# Altium project ESP32_CUSTOM.PrjPcb (part 1 of 3)
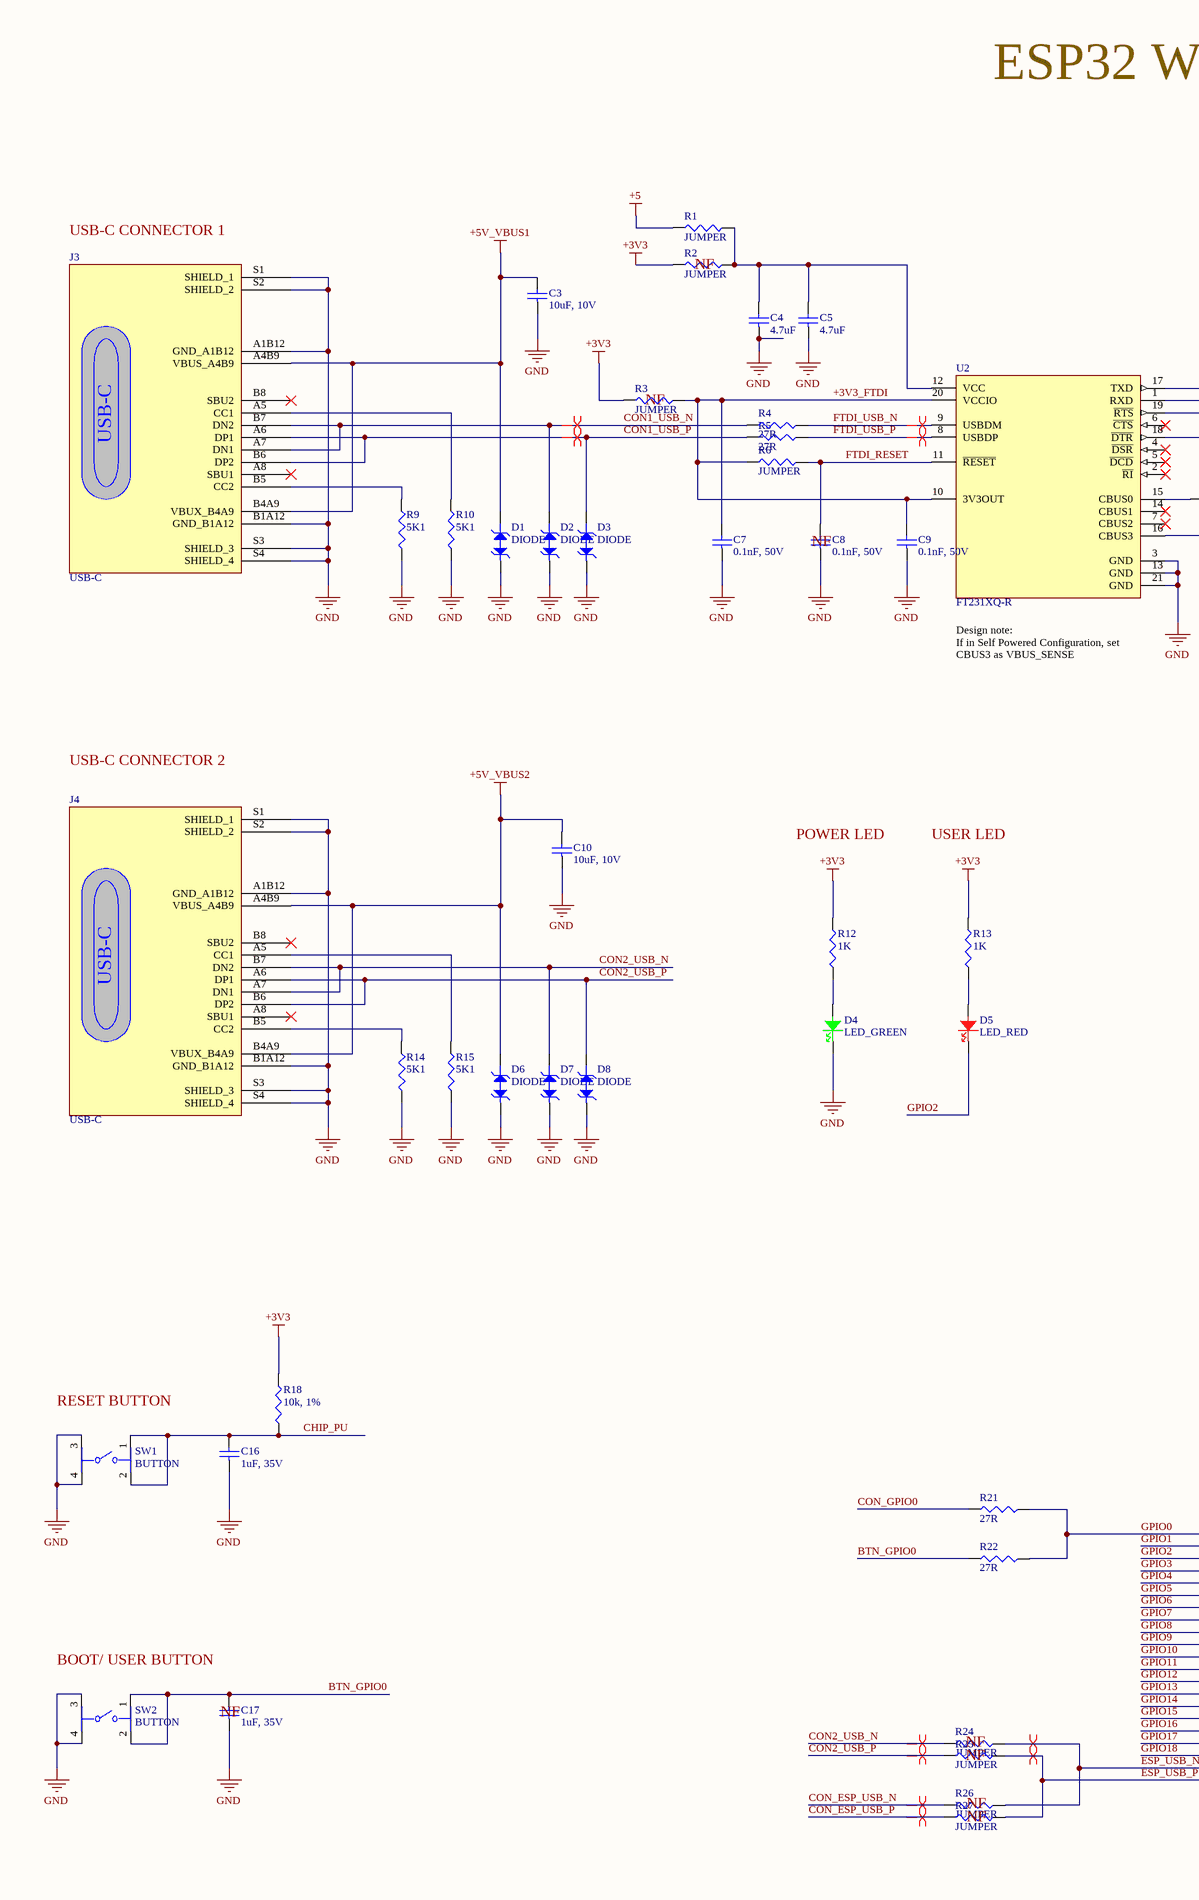
[diagram p0: Sheet1.SchDoc, left]
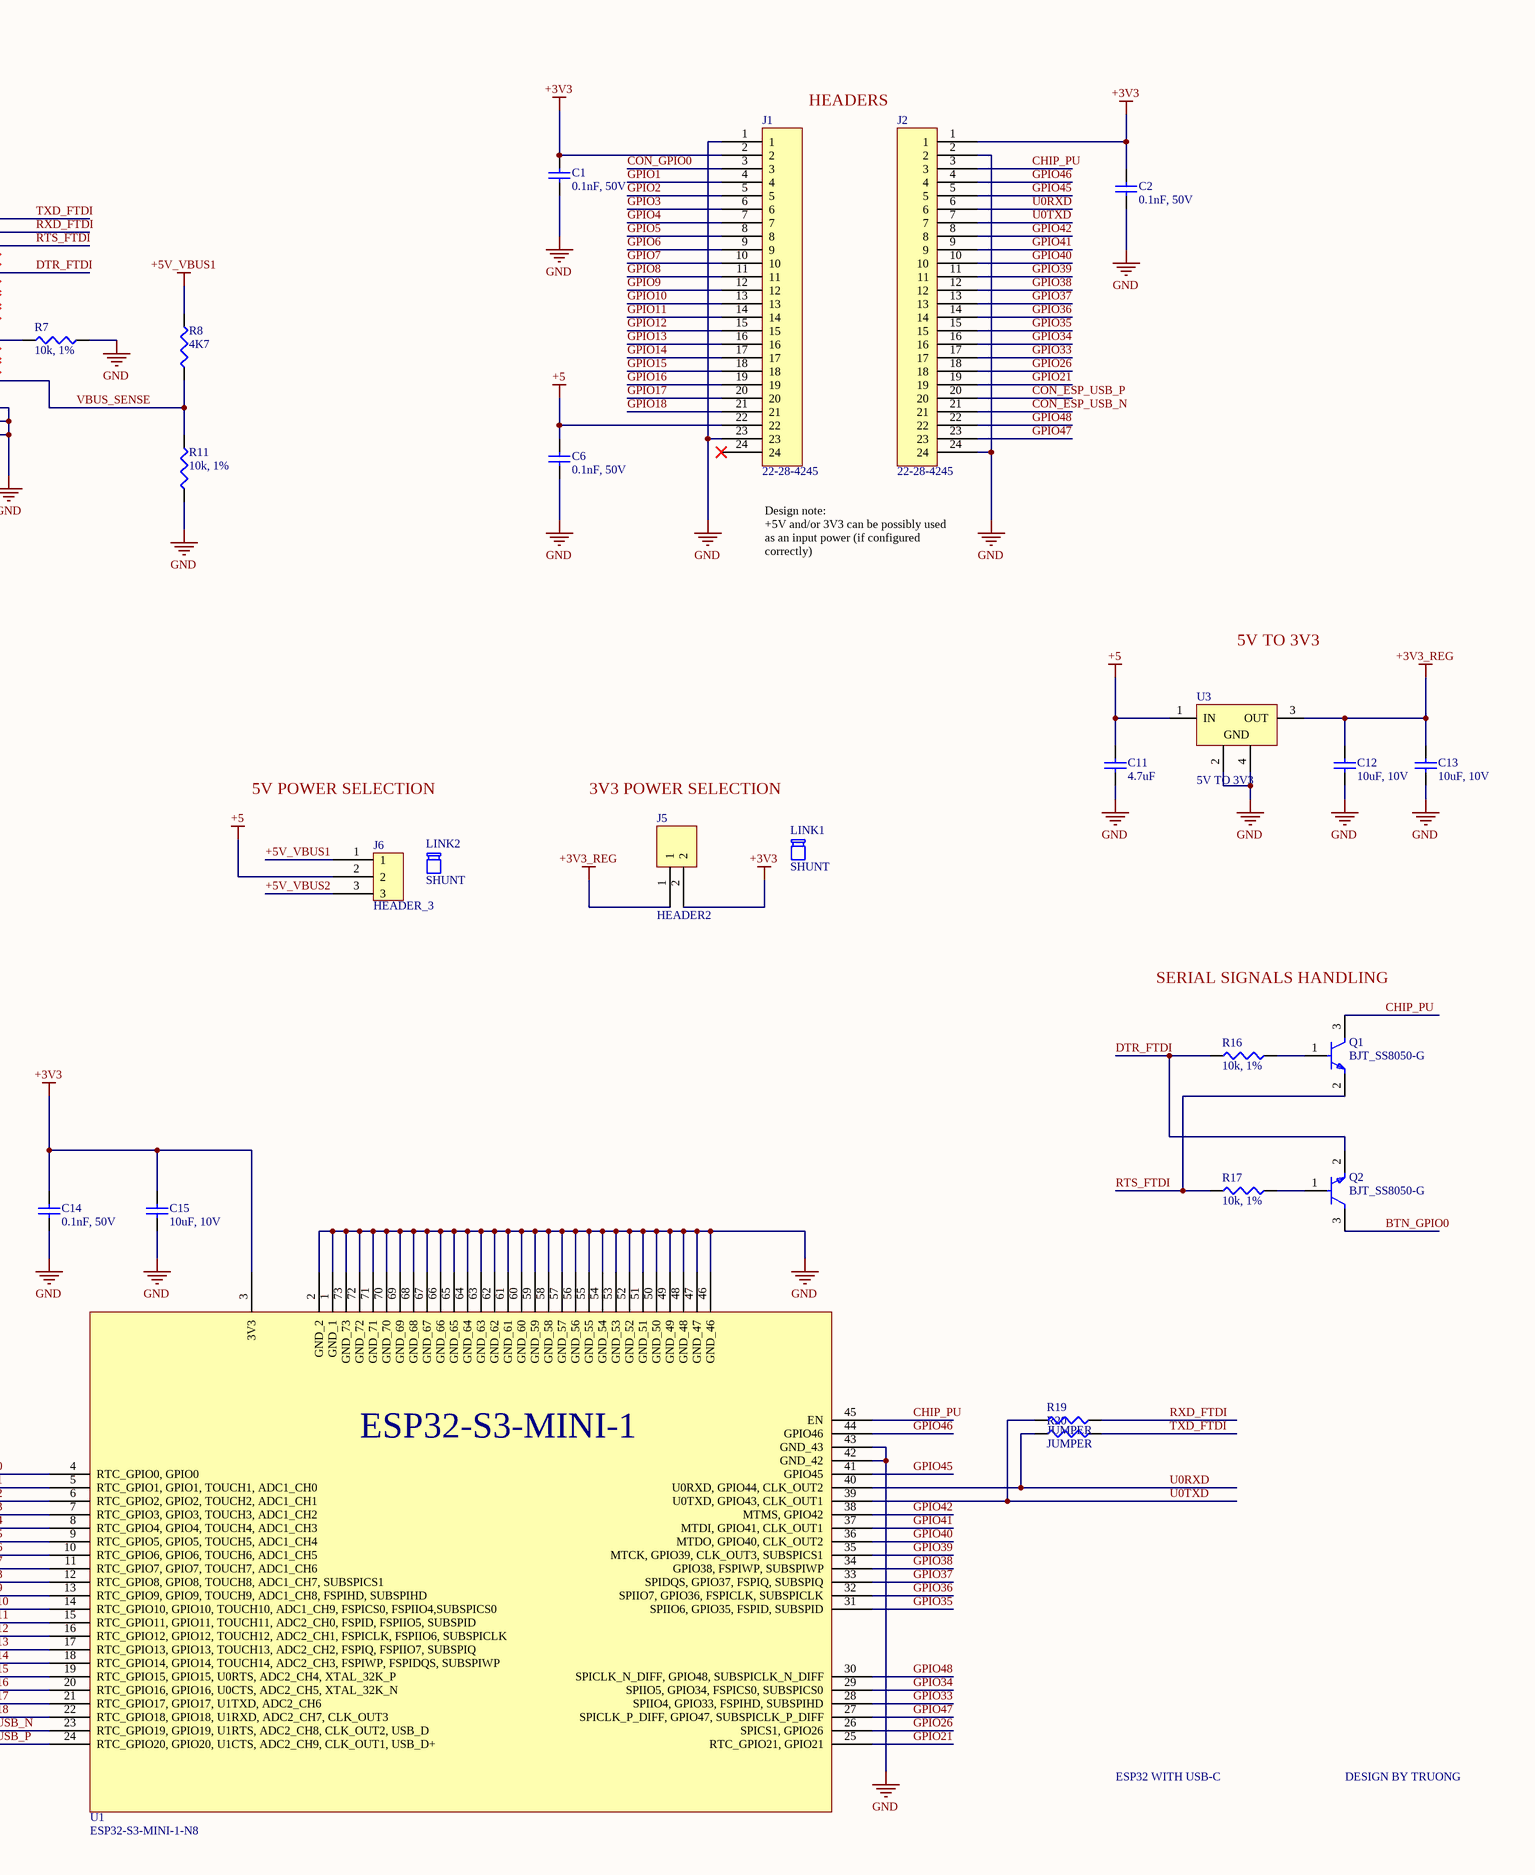
[diagram p1: Sheet1.SchDoc, right]
1 sheet, 66 parts. Net scope: global (net labels, ports and power ports of the same name join across sheets).
Board file: PCB_ESP32.PcbDoc

## Sheet Sheet1.SchDoc
size A2; SheetNumber: 1; SheetTotal: 1

### Parts
C1  0.1nF, 50V  [CAPC1005X70N]
C2  0.1nF, 50V  [CAPC1005X70N]
C3  10uF, 10V  [CAPC1005X70N]
C4  4.7uF  [CAPC1005X70N]
C5  4.7uF  [CAPC1005X70N]
C6  0.1nF, 50V  [CAPC1005X70N]
C7  0.1nF, 50V  [CAPC1005X70N]
C8  0.1nF, 50V  [CAPC1005X70N]
C9  0.1nF, 50V  [CAPC1005X70N]
C10  10uF, 10V  [CAPC1005X70N]
C11  4.7uF  [CAPC1005X70N]
C12  10uF, 10V  [CAPC1005X70N]
C13  10uF, 10V  [CAPC1005X70N]
C14  0.1nF, 50V  [CAPC1005X70N]
C15  10uF, 10V  [CAPC1005X70N]
C16  1uF, 35V  [CAPC1005X70N]
C17  1uF, 35V  [CAPC1005X70N]
D1  DIODE  [SOD882]
D2  DIODE  [SOD882]
D3  DIODE  [SOD882]
D4  LED_GREEN  [LED0402_GREEN]
D5  LED_RED  [LED0402_RED]
D6  DIODE  [SOD882]
D7  DIODE  [SOD882]
D8  DIODE  [SOD882]
J1  22-28-4245  [HDR_1X24_2.55MM]
J2  22-28-4245  [HDR_1X24_2.55MM]
J3  USB-C  [FP-2171790001-MFG]
J4  USB-C  [FP-2171790001-MFG]
J5  HEADER2  [HDR_1X2_1.27MM]
J6  HEADER_3  [HDR_1X3_1.27MM]
LINK1  SHUNT  (mechanical)
LINK2  SHUNT  (mechanical)
Q1  BJT_SS8050-G  [FP-SS8050-G-IPC_B]
Q2  BJT_SS8050-G  [FP-SS8050-G-IPC_B]
R1  JUMPER  [RESC1005X40N]
R2  JUMPER  [RESC1005X40N]
R3  JUMPER  [RESC1005X40N]
R4  27R  [RESC1005X40N]
R5  27R  [RESC1005X40N]
R6  JUMPER  [RESC1005X40N]
R7  10k, 1%  [RESC1005X40N]
R8  4K7  [RESC1005X40N]
R9  5K1  [RESC1005X40N]
R10  5K1  [RESC1005X40N]
R11  10k, 1%  [RESC1005X40N]
R12  1K  [RESC1005X40N]
R13  1K  [RESC1005X40N]
R14  5K1  [RESC1005X40N]
R15  5K1  [RESC1005X40N]
R16  10k, 1%  [RESC1005X40N]
R17  10k, 1%  [RESC1005X40N]
R18  10k, 1%  [RESC1005X40N]
R19  JUMPER  [RESC1005X40N]
R20  JUMPER  [RESC1005X40N]
R21  27R  [RESC1005X40N]
R22  27R  [RESC1005X40N]
R24  JUMPER  [RESC1005X40N]
R25  JUMPER  [RESC1005X40N]
R26  JUMPER  [RESC1005X40N]
R27  JUMPER  [RESC1005X40N]
SW1  BUTTON  [FP-PTS645SM43SMTR92LFS-MFG]
SW2  BUTTON  [FP-PTS645SM43SMTR92LFS-MFG]
U1  ESP32-S3-MINI-1-N8  [XCVR_ESP32-S3-MINI-1-N8]
U2  FT231XQ-R  [FP-QFN-20-IPC_B]
U3  5V TO 3V3  [DCY0004A_N]

### Nets
+3V3: C1.2 C2.2 C14.2 C15.2 J1.2 J2.1 J5.2 R2.1 R3.1 R12.2 R13.2 R18.2 U1.3(3V3)
+3V3_REG: C12.2 C13.2 J5.1 U3.3(OUT)
+5: C6.2 C11.2 J1.22 J6.2 R1.1 U3.1(IN)
+5V_VBUS1: C3.2 D1.2 J3.A4B9(VBUS_A4B9) J3.B4A9(VBUX_B4A9) J6.1 R8.2
+5V_VBUS2: C10.2 D6.2 J4.A4B9(VBUS_A4B9) J4.B4A9(VBUX_B4A9) J6.3
GND: C1.1 C2.1 C3.1 C4.1 C5.1 C6.1 C7.1 C8.1 C9.1 C10.1 C11.1 C12.1 C13.1 C14.1 C15.1 C16.1 C17.1 D1.1 D2.1 D3.1 D4.1 D6.1 D7.1 D8.1 J1.1 J1.23 J2.2 J2.24 J3.A1B12(GND_A1B12) J3.B1A12(GND_B1A12) J3.S1(SHIELD_1) J3.S2(SHIELD_2) J3.S3(SHIELD_3) J3.S4(SHIELD_4) J4.A1B12(GND_A1B12) J4.B1A12(GND_B1A12) J4.S1(SHIELD_1) J4.S2(SHIELD_2) J4.S3(SHIELD_3) J4.S4(SHIELD_4) R7.2 R9.2 R10.2 R11.1 R14.2 R15.2 SW1.3 SW1.4 SW2.3 SW2.4 U1.1(GND_1) U1.2(GND_2) U1.42(GND_42) U1.43(GND_43) U1.46(GND_46) U1.47(GND_47) U1.48(GND_48) U1.49(GND_49) U1.50(GND_50) U1.51(GND_51) U1.52(GND_52) U1.53(GND_53) U1.54(GND_54) U1.55(GND_55) U1.56(GND_56) U1.57(GND_57) U1.58(GND_58) U1.59(GND_59) U1.60(GND_60) U1.61(GND_61) U1.62(GND_62) U1.63(GND_63) U1.64(GND_64) U1.65(GND_65) U1.66(GND_66) U1.67(GND_67) U1.68(GND_68) U1.69(GND_69) U1.70(GND_70) U1.71(GND_71) U1.72(GND_72) U1.73(GND_73) U2.3(GND) U2.13(GND) U2.21(GND) U3.2(GND) U3.4(GND)
+3V3_FTDI: C7.2 C9.2 R3.2 R6.1 U2.10(3V3OUT) U2.20(VCCIO)
BTN_GPIO0: C17.2 Q2.3(C) R22.1 SW2.1 SW2.2
CHIP_PU: C16.2 J2.3 Q1.3(C) R18.1 SW1.1 SW1.2 U1.45(EN)
CON1_USB_N: D2.2 J3.A7(DN1) J3.B7(DN2) R4.1
CON1_USB_P: D3.2 J3.A6(DP1) J3.B6(DP2) R5.1
CON2_USB_N: D7.2 J4.A7(DN1) J4.B7(DN2) R24.1
CON2_USB_P: D8.2 J4.A6(DP1) J4.B6(DP2) R25.1
CON_ESP_USB_N: J2.21 R26.1
CON_ESP_USB_P: J2.20 R27.1
CON_GPIO0: J1.3 R21.1
DTR_FTDI: Q2.2(E) R16.1 U2.18(~{DTR})
ESP_USB_N: R24.2 R26.2 U1.23(RTC_GPIO19,_GPIO19,_U1RTS,_ADC2_CH8,_CLK_OUT2,_USB_D)
ESP_USB_P: R25.2 R27.2 U1.24(RTC_GPIO20,_GPIO20,_U1CTS,_ADC2_CH9,_CLK_OUT1,_USB_D+)
FTDI_RESET: C8.2 R6.2 U2.11(~{RESET})
FTDI_USB_N: R4.2 U2.9(USBDM)
FTDI_USB_P: R5.2 U2.8(USBDP)
GPIO0: R21.2 R22.2 U1.4(RTC_GPIO0,_GPIO0)
GPIO1: J1.4 U1.5(RTC_GPIO1,_GPIO1,_TOUCH1,_ADC1_CH0)
GPIO2: D5.1 J1.5 U1.6(RTC_GPIO2,_GPIO2,_TOUCH2,_ADC1_CH1)
GPIO3: J1.6 U1.7(RTC_GPIO3,_GPIO3,_TOUCH3,_ADC1_CH2)
GPIO4: J1.7 U1.8(RTC_GPIO4,_GPIO4,_TOUCH4,_ADC1_CH3)
GPIO5: J1.8 U1.9(RTC_GPIO5,_GPIO5,_TOUCH5,_ADC1_CH4)
GPIO6: J1.9 U1.10(RTC_GPIO6,_GPIO6,_TOUCH6,_ADC1_CH5)
GPIO7: J1.10 U1.11(RTC_GPIO7,_GPIO7,_TOUCH7,_ADC1_CH6)
GPIO8: J1.11 U1.12(RTC_GPIO8,_GPIO8,_TOUCH8,_ADC1_CH7,_SUBSPICS1)
GPIO9: J1.12 U1.13(RTC_GPIO9,_GPIO9,_TOUCH9,_ADC1_CH8,_FSPIHD,_SUBSPIHD)
GPIO10: J1.13 U1.14(RTC_GPIO10,_GPIO10,_TOUCH10,_ADC1_CH9,_FSPICS0,_FSPIIO4,SUBSPICS0)
GPIO11: J1.14 U1.15(RTC_GPIO11,_GPIO11,_TOUCH11,_ADC2_CH0,_FSPID,_FSPIIO5,_SUBSPID)
GPIO12: J1.15 U1.16(RTC_GPIO12,_GPIO12,_TOUCH12,_ADC2_CH1,_FSPICLK,_FSPIIO6,_SUBSPICLK)
GPIO13: J1.16 U1.17(RTC_GPIO13,_GPIO13,_TOUCH13,_ADC2_CH2,_FSPIQ,_FSPIIO7,_SUBSPIQ)
GPIO14: J1.17 U1.18(RTC_GPIO14,_GPIO14,_TOUCH14,_ADC2_CH3,_FSPIWP,_FSPIDQS,_SUBSPIWP)
GPIO15: J1.18 U1.19(RTC_GPIO15,_GPIO15,_U0RTS,_ADC2_CH4,_XTAL_32K_P)
GPIO16: J1.19 U1.20(RTC_GPIO16,_GPIO16,_U0CTS,_ADC2_CH5,_XTAL_32K_N)
GPIO17: J1.20 U1.21(RTC_GPIO17,_GPIO17,_U1TXD,_ADC2_CH6)
GPIO18: J1.21 U1.22(RTC_GPIO18,_GPIO18,_U1RXD,_ADC2_CH7,_CLK_OUT3)
GPIO21: J2.19 U1.25(RTC_GPIO21,_GPIO21)
GPIO26: J2.18 U1.26(SPICS1,_GPIO26)
GPIO33: J2.17 U1.28(SPIIO4,_GPIO33,_FSPIHD,_SUBSPIHD)
GPIO34: J2.16 U1.29(SPIIO5,_GPIO34,_FSPICS0,_SUBSPICS0)
GPIO35: J2.15 U1.31(SPIIO6,_GPIO35,_FSPID,_SUBSPID)
GPIO36: J2.14 U1.32(SPIIO7,_GPIO36,_FSPICLK,_SUBSPICLK)
GPIO37: J2.13 U1.33(SPIDQS,_GPIO37,_FSPIQ,_SUBSPIQ)
GPIO38: J2.12 U1.34(GPIO38,_FSPIWP,_SUBSPIWP)
GPIO39: J2.11 U1.35(MTCK,_GPIO39,_CLK_OUT3,_SUBSPICS1)
GPIO40: J2.10 U1.36(MTDO,_GPIO40,_CLK_OUT2)
GPIO41: J2.9 U1.37(MTDI,_GPIO41,_CLK_OUT1)
GPIO42: J2.8 U1.38(MTMS,_GPIO42)
GPIO45: J2.5 U1.41(GPIO45)
GPIO46: J2.4 U1.44(GPIO46)
GPIO47: J2.23 U1.27(SPICLK_P_DIFF,_GPIO47,_SUBSPICLK_P_DIFF)
GPIO48: J2.22 U1.30(SPICLK_N_DIFF,_GPIO48,_SUBSPICLK_N_DIFF)
RTS_FTDI: Q1.2(E) R17.1 U2.19(~{RTS})
RXD_FTDI: R19.2 U2.1(RXD)
TXD_FTDI: R20.2 U2.17(TXD)
U0RXD: J2.6 R20.1 U1.40(U0RXD,_GPIO44,_CLK_OUT2)
U0TXD: J2.7 R19.1 U1.39(U0TXD,_GPIO43,_CLK_OUT1)
VBUS_SENSE: R8.1 R11.2 U2.16(CBUS3)
NetC4_2: C4.2 C5.2 R1.2 R2.2 U2.12(VCC)
NetD4_2: D4.2 R12.1
NetD5_2: D5.2 R13.1
NetJ3_A5: J3.A5(CC1) R10.1
NetJ3_B5: J3.B5(CC2) R9.1
NetJ4_A5: J4.A5(CC1) R15.1
NetJ4_B5: J4.B5(CC2) R14.1
NetQ1_1: Q1.1(B) R16.2
NetQ2_1: Q2.1(B) R17.2
NetR7_1: R7.1 U2.15(CBUS0)

Not connected (* = marked no-connect by the designer): J1 24*; J3 A8(SBU1)* B8(SBU2)*; J4 A8(SBU1)* B8(SBU2)*; U2 2(~{RI})* 4(~{DSR})* 5(~{DCD})* 6(~{CTS})* 7(CBUS2)* 14(CBUS1)*

### Layout directives
differential pair; differential pair class DIFF90: CON1_USB_N, CON1_USB_P, CON2_USB_N, CON2_USB_P, CON_ESP_USB_N, CON_ESP_USB_P, ESP_USB_N, ESP_USB_P, FTDI_USB_N, FTDI_USB_P

### Notes on the sheet
- ESP32 WITH USB-C
- USB-C CONNECTOR 1
- (near R2) NF
- HEADERS
- (near R3) NF
- (near C8) NF
- (near U2) Design note:
  If in Self Powered Configuration, set CBUS3 as VBUS_SENSE
- Design note:
  +5V and/or 3V3 can be possibly used as an input power (if configured correctly)
- USB-C CONNECTOR 2
- 5V TO 3V3
- POWER LED
- USER LED
- 5V POWER SELECTION
- 3V3 POWER SELECTION
- SERIAL SIGNALS HANDLING
- RESET BUTTON
- BOOT/ USER BUTTON
- (near C17) NF
- (near R24) NF
- (near R25) NF
- (near R26) NF
- (near R27) NF
- DESIGN BY TRUONG
- (in symbol ESP32-S3-MINI-1-N8 (2)) ESP32-S3-MINI-1